# EAGLE design TQFP-32_to_DIP-32 (EAGLE 8.5.1)
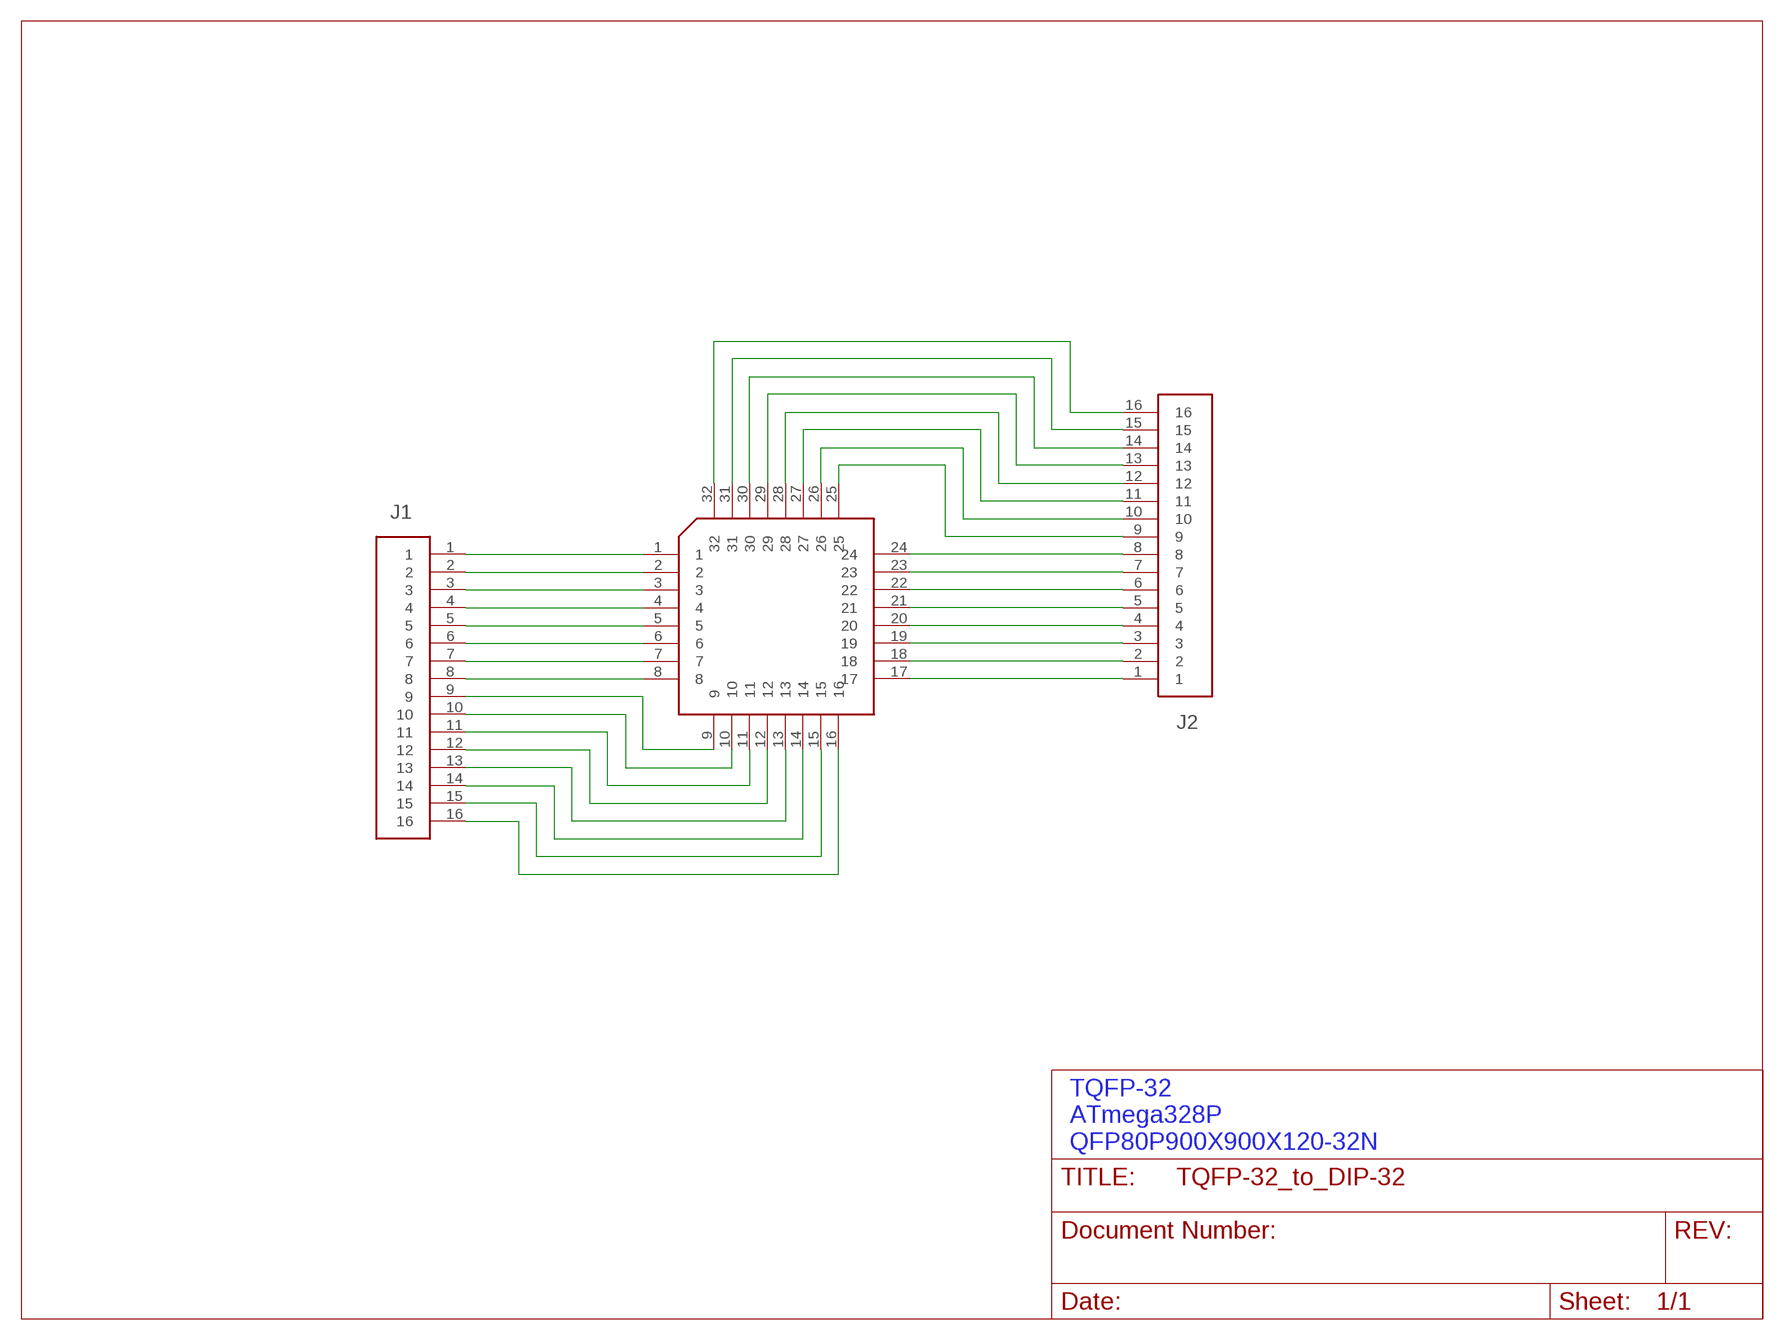
[diagram p0: schematic, sheet 1]

## Parts
J1  CONNECTOR_16  [68000-116HLF]
J2  CONNECTOR_16-NO_SQUARE  [68000-116HLF-NO-SQUARE]
U1  IC-GENERIC-TQFP-32  [QFP80P900X900X120-32N]

## Nets
N$1: J1.1 U1.1
N$2: J1.2 U1.2
N$3: J1.3 U1.3
N$4: J1.4 U1.4
N$5: J1.5 U1.5
N$6: J1.6 U1.6
N$7: J1.7 U1.7
N$8: J1.8 U1.8
N$9: J2.1 U1.17
N$10: J2.2 U1.18
N$11: J2.3 U1.19
N$12: J2.4 U1.20
N$13: J2.5 U1.21
N$14: J2.6 U1.22
N$15: J2.7 U1.23
N$16: J2.8 U1.24
N$17: J1.9 U1.9
N$18: J1.10 U1.10
N$19: J1.11 U1.11
N$20: J1.12 U1.12
N$21: J1.13 U1.13
N$22: J1.14 U1.14
N$23: J1.15 U1.15
N$24: J1.16 U1.16
N$25: J2.9 U1.25
N$26: J2.10 U1.26
N$27: J2.11 U1.27
N$28: J2.12 U1.28
N$29: J2.13 U1.29
N$30: J2.14 U1.30
N$31: J2.15 U1.31
N$32: J2.16 U1.32

## Notes on the sheet
- TQFP-32
  ATmega328P
  QFP80P900X900X120-32N

## Library data of the parts
J1 J2 = SnapEDA:CONNECTOR_16
U1 = SnapEDA:IC-GENERIC-TQFP-32

## Board
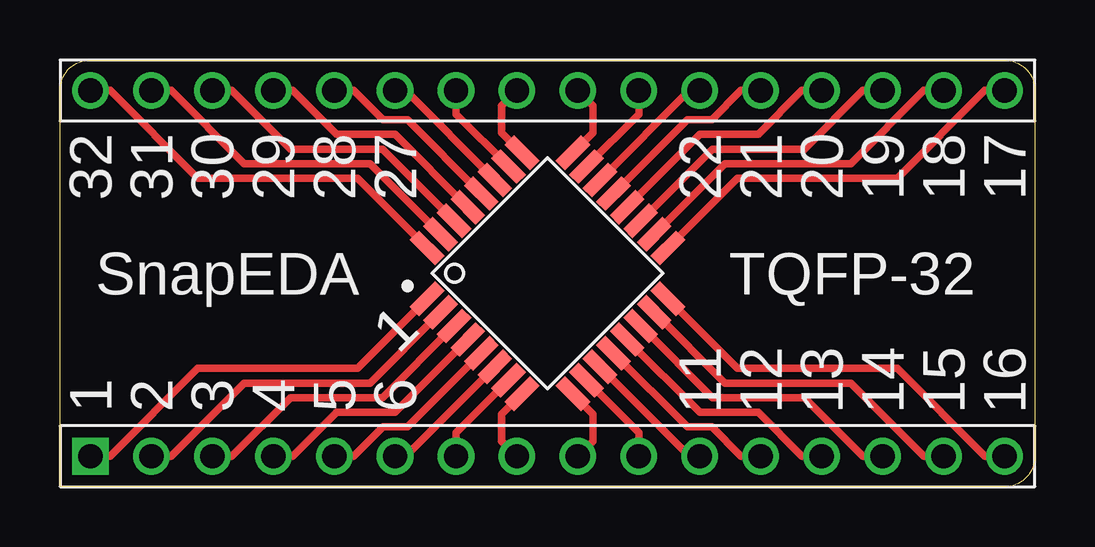
[diagram p1: board, top side]
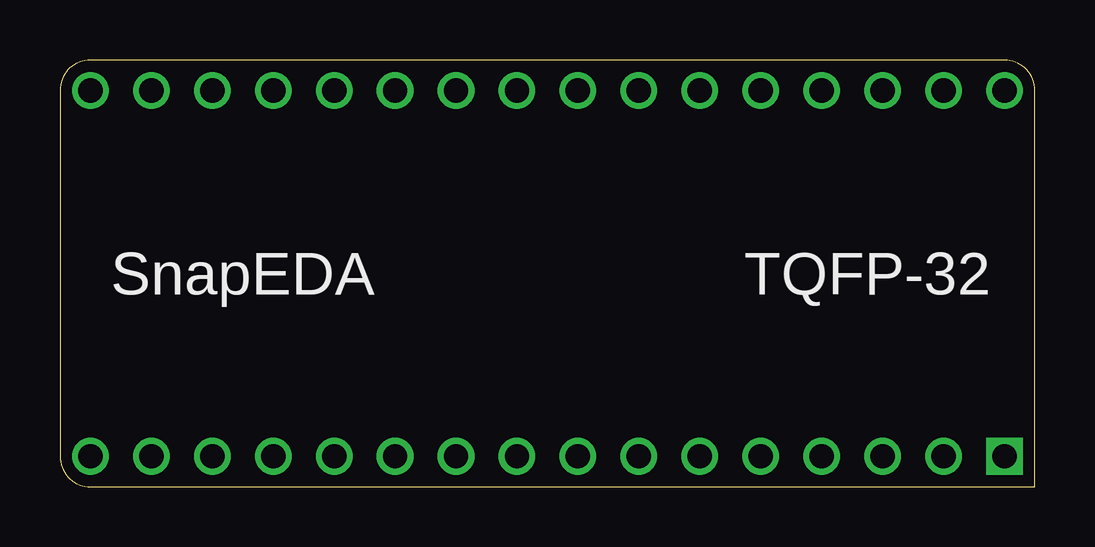
[diagram p2: board, bottom side, seen from below]

Size 40.64 x 17.78 mm. Coordinates in mm from the lower left corner, seen from the top.
Outline: 0,0 0,16.51 arc-90 1.27,17.78 39.37,17.78 arc-90 40.64,16.51 40.64,1.27 arc-90 39.37,0 0,0
Copper layers (1*16): Top 0.035559375mm / dielectric 1.6mm / Bottom 0.035559375mm
Design rules "oshpark-2layer *": minimum track width 12mil, minimum drill 10mil, track to track 12mil, track to pad 12mil, pad to pad 6mil, via to via 6mil, smd to smd 6mil, copper to edge 15mil, drill to drill 6mil, minimum pad ring 5mil, minimum via ring 5mil, stop-mask expansion 2.5mil, vias tented up to drill 0mil, thermal gap 10mil

### Footprints (pad centres in the part's own frame; a part is rotated, then mirrored left to right if it is on the bottom)
68000-116HLF = drill 1.016 square: 1 0,0 | drill 1.016: 2 2.54,0; 3 5.08,0; 4 7.62,0; 5 10.16,0; 6 12.7,0; 7 15.24,0; 8 17.78,0; 9 20.32,0; 10 22.86,0; 11 25.4,0; 12 27.94,0; 13 30.48,0; 14 33.02,0; 15 35.56,0; 16 38.1,0
68000-116HLF-NO-SQUARE = drill 1.016: 1 0,0; 2 2.54,0; 3 5.08,0; 4 7.62,0; 5 10.16,0; 6 12.7,0; 7 15.24,0; 8 17.78,0; 9 20.32,0; 10 22.86,0; 11 25.4,0; 12 27.94,0; 13 30.48,0; 14 33.02,0; 15 35.56,0; 16 38.1,0
QFP80P900X900X120-32N = smd 1.5 x 0.55: 1 -4.3,2.8; 2 -4.3,2; 3 -4.3,1.2; 4 -4.3,0.4; 5 -4.3,-0.4; 6 -4.3,-1.2; 7 -4.3,-2; 8 -4.3,-2.8; 17 4.3,-2.8; 18 4.3,-2; 19 4.3,-1.2; 20 4.3,-0.4; 21 4.3,0.4; 22 4.3,1.2; 23 4.3,2; 24 4.3,2.8 | smd 0.55 x 1.5: 9 -2.8,-4.3; 10 -2,-4.3; 11 -1.2,-4.3; 12 -0.4,-4.3; 13 0.4,-4.3; 14 1.2,-4.3; 15 2,-4.3; 16 2.8,-4.3; 25 2.8,4.3; 26 2,4.3; 27 1.2,4.3; 28 0.4,4.3; 29 -0.4,4.3; 30 -1.2,4.3; 31 -2,4.3; 32 -2.8,4.3

### Placement (x,y rotation side)
J1  1.27,1.27 0 top
J2  39.37,16.51 180 top
U1  20.32,8.89 45 top

### Tracks (layer width: path | path; a pad name or v marks a point on that pad's centre or on a via)
N$1
  Top 0.305: U1.1 12.4,4.93 5.74,4.93 2.09,1.27 J1.1
N$2
  Top 0.305: U1.2 12.92,4.32 7.67,4.32 4.63,1.27 J1.2
N$3
  Top 0.305: U1.3 13.44,3.71 9.6,3.71 7.17,1.27 J1.3
N$4
  Top 0.305: U1.4 13.96,3.1 11.54,3.1 9.71,1.27 J1.4
N$5
  Top 0.305: U1.5 14.48,2.49 13.46,2.49 12.25,1.27 J1.5
N$6
  Top 0.305: U1.6 14.4,1.27 J1.6
N$7
  Top 0.305: U1.7 16.51,2.25 J1.7
N$8
  Top 0.305: U1.8 18.41,3.02 18.41,1.91 J1.8
N$9
  Top 0.305: U1.17 28.24,12.85 34.9,12.85 38.55,16.51 J2.1
N$10
  Top 0.305: U1.18 27.72,13.46 32.97,13.46 36.01,16.51 J2.2
N$11
  Top 0.305: U1.19 27.2,14.07 31.04,14.07 33.47,16.51 J2.3
N$12
  Top 0.305: U1.20 26.68,14.68 29.11,14.68 30.93,16.51 J2.4
N$13
  Top 0.305: U1.21 26.16,15.29 27.18,15.29 28.39,16.51 J2.5
N$14
  Top 0.305: U1.22 26.24,16.51 J2.6
N$15
  Top 0.305: U1.23 24.13,15.53 J2.7
N$16
  Top 0.305: U1.24 22.23,14.76 22.23,15.88 J2.8
N$17
  Top 0.305: U1.9 22.23,3.02 22.23,1.91 J1.9
N$18
  Top 0.305: U1.10 24.13,2.25 J1.10
N$19
  Top 0.305: U1.11 26.24,1.27 J1.11
N$20
  Top 0.305: U1.12 26.16,2.49 27.18,2.49 28.39,1.27 J1.12
N$21
  Top 0.305: U1.13 26.68,3.1 29.11,3.1 30.93,1.27 J1.13
N$22
  Top 0.305: U1.14 27.2,3.71 31.04,3.71 33.47,1.27 J1.14
N$23
  Top 0.305: U1.15 27.72,4.32 32.97,4.32 36.01,1.27 J1.15
N$24
  Top 0.305: U1.16 28.24,4.93 34.9,4.93 38.55,1.27 J1.16
N$25
  Top 0.305: U1.25 18.41,14.76 18.41,15.88 J2.9
N$26
  Top 0.305: U1.26 16.51,15.53 J2.10
N$27
  Top 0.305: U1.27 14.4,16.51 J2.11
N$28
  Top 0.305: U1.28 14.48,15.29 13.46,15.29 12.25,16.51 J2.12
N$29
  Top 0.305: U1.29 13.96,14.68 11.54,14.68 9.71,16.51 J2.13
N$30
  Top 0.305: U1.30 13.44,14.07 9.6,14.07 7.17,16.51 J2.14
N$31
  Top 0.305: U1.31 12.92,13.46 7.67,13.46 4.63,16.51 J2.15
N$32
  Top 0.305: U1.32 12.4,12.85 5.74,12.85 2.09,16.51 J2.16

### Text on the board
tPlace: 32 | 31 | 30 | 29 | 28 | 27 | 22 | 21 | 20 | 19 | 18 | 17 | SnapEDA | TQFP-32 | 1 | 1 | 2 | 3 | 4 | 5 | 6 | 11 | 12 | 13 | 14 | 15 | 16
bPlace: TQFP-32 | SnapEDA